# Altium schematic sheet MapleBreakout.SchDoc: Maple Breakout Board
size A; DrawnBy: Zeigren; Revision: 1; SheetNumber: 1; SheetTotal: 1
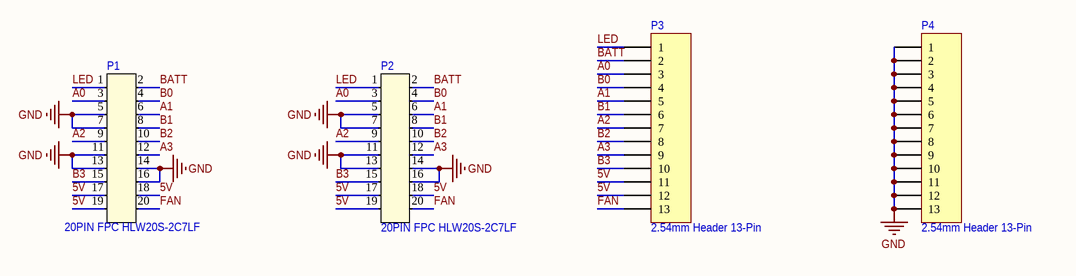
[diagram p0: MapleBreakout.SchDoc]

## Parts
P1  20PIN FPC HLW20S-2C7LF  [HLW20S-2C7LF]
P2  20PIN FPC HLW20S-2C7LF  [HLW20S-2C7LF]
P3  2.54mm Header 13-Pin  [HDR1X13]
P4  2.54mm Header 13-Pin  [HDR1X13]

## Nets
GND: P1.5 P1.7 P1.11 P1.13 P1.14 P1.16 P2.5 P2.7 P2.11 P2.13 P2.14 P2.16 P4.1 P4.2 P4.3 P4.4 P4.5 P4.6 P4.7 P4.8 P4.9 P4.10 P4.11 P4.12 P4.13
5V: P1.17 P1.18 P1.19 P2.17 P2.18 P2.19 P3.11 P3.12
A0: P1.3 P2.3 P3.3
A1: P1.6 P2.6 P3.5
A2: P1.9 P2.9 P3.7
A3: P1.12 P2.12 P3.9
B0: P1.4 P2.4 P3.4
B1: P1.8 P2.8 P3.6
B2: P1.10 P2.10 P3.8
B3: P1.15 P2.15 P3.10
BATT: P1.2 P2.2 P3.2
FAN: P1.20 P2.20 P3.13
LED: P1.1 P2.1 P3.1

## Notes on the sheet
- Drawn By:
- Date:
- Time:
- Size:
- A
- Revision:
- Sheet:
- of
- Copyright Zeigren 2019. www.zeigren.com
  This documentation describes Open Hardware and is licensed under the CERN OHL v.1.2.
  You may redistribute and modify this documentation under the terms of the CERN OHL v.1.2.(http://ohwr.org/cernohl).
  This documentation is distributed WITHOUT ANY EXPRESS OR IMPLIED WARRANTY, INCLUDING OF MERCHANTABILITY, SATISFACTORY QUALITY AND FITNESS FOR A PARTICULAR PURPOSE.
  Please see the CERN OHL v.1.2 for applicable conditions
- File:

## Library data of the parts
P1 P2 = 20PIN FPC HLW20S-2C7LF: Manufacturer: Amphenol FCI; Flat Flex Type: FFC, FPC; Connector/Contact Type: Contacts, Vertical, 1 Sided; Number of Positions: 20; Pitch: 0.039" (1.00mm); FFC, FCB Thickness: 0.30mm; Cable End Type: Straight or Tapered; Voltage Rating: 100V; Material Flammability Rating: UL94 V-0; Current Rating: 1A; Mating Cycles: 30; Supplier 1: Digi-Key; Supplier Part Number 1: 609-1835-ND; Manufacturer Part Number: HLW20S-2C7LF; RoHS: RoHS Compliant; Category: Connectors, Interconnects; Stock 1: 11610; Pricing 1: 1=0.22, 10=0.206, 25=0.1752, 50=0.1534, 100=0.1425, 250=0.12604, 500=0.12056, 1000=0.09864, 2500=0.09042 (USD); Packaging: Tray; Part Status: Active; Mounting Type: Through Hole; Termination: Kinked Pin; Height Above Board: 0.232" (5.90mm); Locking Feature: -; Contact Material: Phosphor Bronze; Contact Finish: Tin; Housing Material: Polybutylene Terephthalate (PBT), Glass Filled; Actuator Material: -; Features: -; Operating Temperature: -55°C ~ 85°C; Contact Finish Thickness: -; Housing Color: Black; Actuator Color: -; ComponentLink1URL: https://cdn.amphenol-icc.com/media/wysiwyg/files/drawing/hlw01lf.pdf; ComponentLink1Description: https://cdn.amphenol-icc.com/media/wysiwyg/files/drawing/hlw01lf.pdf
P3 P4 = Header 13: LatestRevisionDate: 17-Jul-2002; LatestRevisionNote: Re-released for DXP Platform.; Publisher: Altium Limited